# EAGLE design fie (EAGLE 6.6.0)
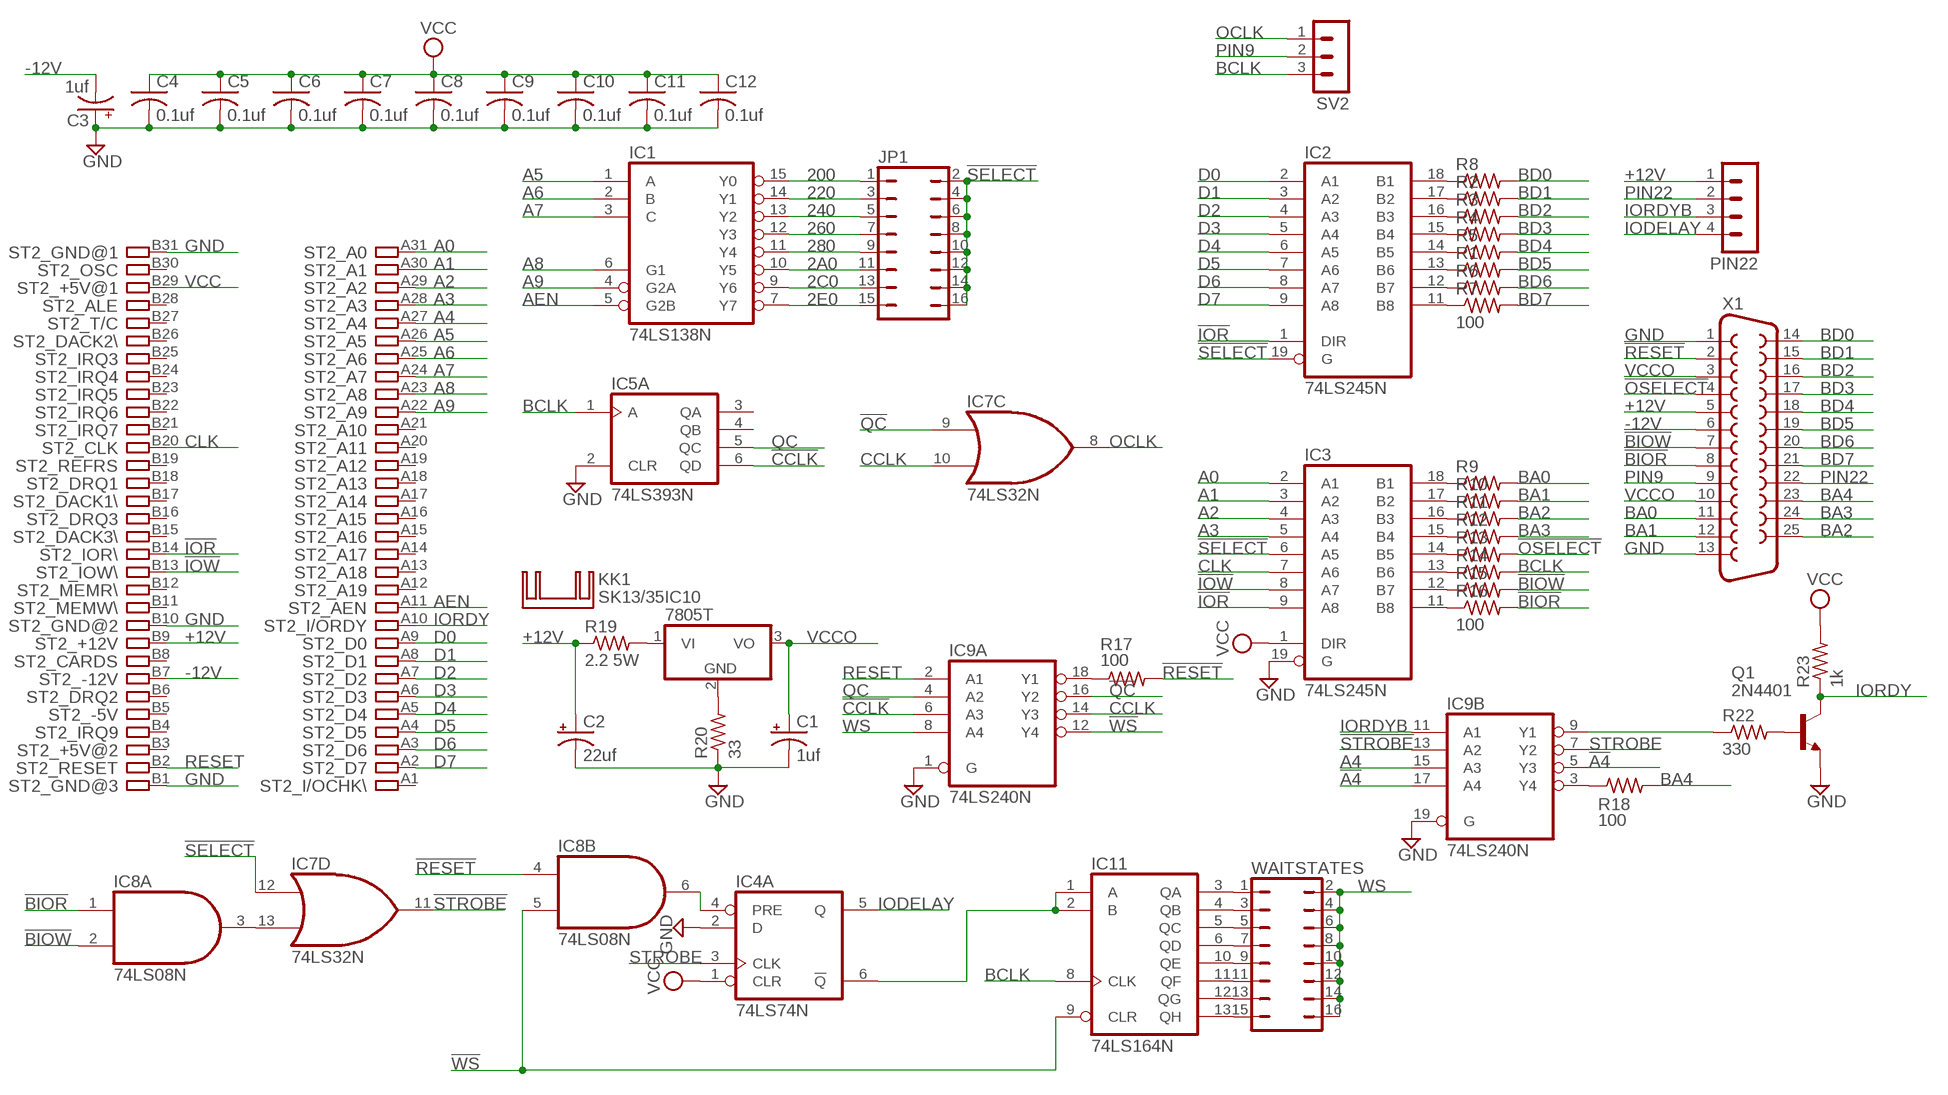
[diagram p0: schematic, sheet 1]

## Parts
C1  1uf  CPOL-USE5-10.5  [E5-10,5]
C2  22uf  CPOL-USE5-10.5  [E5-10,5]
C3  1uf  CPOL-USE5-10.5  [E5-10,5]
C4  0.1uf  C-US050-025X075  [C050-025X075]
C5  0.1uf  C-US050-025X075  [C050-025X075]
C6  0.1uf  C-US050-025X075  [C050-025X075]
C7  0.1uf  C-US050-025X075  [C050-025X075]
C8  0.1uf  C-US050-025X075  [C050-025X075]
C9  0.1uf  C-US050-025X075  [C050-025X075]
C10  0.1uf  C-US050-025X075  [C050-025X075]
C11  0.1uf  C-US050-025X075  [C050-025X075]
C12  0.1uf  C-US050-025X075  [C050-025X075]
IC1  74LS138N  [DIL16]
IC2  74LS245N  [DIL20]
IC3  74LS245N  [DIL20]
IC4  74LS74N  [DIL14]
IC5  74LS393N  [DIL14]
IC7  74LS32N  [DIL14]
IC8  74LS08N  [DIL14]
IC9  74LS240N  [DIL20]
IC10  7805T  [TO220H]
IC11  74LS164N  [DIL14]
JP1  JP8Q  [JP8Q]
KK1  SK13/35  [SK13/35]
PIN22  MA04-1  [MA04-1]
Q1  2N4401  2N4416  [TO92]
R1  R-US_0207/10  [0207/10]
R2  R-US_0207/10  [0207/10]
R3  R-US_0207/10  [0207/10]
R4  R-US_0207/10  [0207/10]
R5  R-US_0207/10  [0207/10]
R6  R-US_0207/10  [0207/10]
R7  100  R-US_0207/10  [0207/10]
R8  R-US_0207/10  [0207/10]
R9  R-US_0207/10  [0207/10]
R10  R-US_0207/10  [0207/10]
R11  R-US_0207/10  [0207/10]
R12  R-US_0207/10  [0207/10]
R13  R-US_0207/10  [0207/10]
R14  R-US_0207/10  [0207/10]
R15  R-US_0207/10  [0207/10]
R16  100  R-US_0207/10  [0207/10]
R17  100  R-US_0207/10  [0207/10]
R18  100  R-US_0207/10  [0207/10]
R19  2.2 5W  R-US_0922/22  [0922/22]
R20  33  R-US_0207/10  [0207/10]
R22  330  R-US_0207/10  [0207/10]
R23  1k  R-US_0207/10  [0207/10]
ST2  IBM8BIT  [IBM8BIT]
SV2  MA03-1  [MA03-1]
WAITSTATES  JP8Q  [JP8Q]
X1  F25H  [F25H]

## Nets
2A0: IC1.10(Y5) JP1.11
2C0: IC1.9(Y6) JP1.13
2E0: IC1.7(Y7) JP1.15
200: IC1.15(Y0) JP1.1
220: IC1.14(Y1) JP1.3
240: IC1.13(Y2) JP1.5
260: IC1.12(Y3) JP1.7
280: IC1.11(Y4) JP1.9
!A4: IC9.5(B:Y3) IC9.17(B:A4)
!BIOR: IC8.1(A:I0) R16.2 X1.8
!BIOW: IC8.2(A:I1) R15.2 X1.7
!CCLK: IC5.6(A:QD) IC9.6(A:A3)
!IOR: IC2.1(DIR) IC3.9(A8) ST2.B14
!IOW: IC3.8(A7) ST2.B13
!OSELECT: R13.2 X1.4
!QC: IC7.9(C:I0) IC9.16(A:Y2)
!RESET: IC8.4(B:I0) R17.2 X1.2
!SELECT: IC2.19(G) IC3.6(A5) IC7.12(D:I0) JP1.2 JP1.4 JP1.6 JP1.8 JP1.10 JP1.12 JP1.14 JP1.16
!STROBE: IC7.11(D:O) IC9.13(B:A2)
!WS: IC8.5(B:I1) IC9.12(A:Y4) IC11.9(CLR)
+12V [Power]: C2.+ PIN22.1 R19.1 ST2.B9 X1.5
-12V [Power]: C3.- ST2.B7 X1.6
A0: IC3.2(A1) ST2.A31
A1: IC3.3(A2) ST2.A30
A2: IC3.4(A3) ST2.A29
A3: IC3.5(A4) ST2.A28
A4: IC9.15(B:A3) ST2.A27
A5: IC1.1(A) ST2.A26
A6: IC1.2(B) ST2.A25
A7: IC1.3(C) ST2.A24
A8: IC1.6(G1) ST2.A23
A9: IC1.4(G2A) ST2.A22
AEN: IC1.5(G2B) ST2.A11
BA0: R9.2 X1.11
BA1: R10.2 X1.12
BA2: R11.2 X1.25
BA3: R12.2 X1.24
BA4: R18.2 X1.23
BCLK: IC5.1(A:A) IC11.8(CLK) R14.2 SV2.3
BD0: R8.2 X1.14
BD1: R2.2 X1.15
BD2: R3.2 X1.16
BD3: R4.2 X1.17
BD4: R5.2 X1.18
BD5: R1.2 X1.19
BD6: R6.2 X1.20
BD7: R7.2 X1.21
CCLK: IC7.10(C:I1) IC9.14(A:Y3)
CLK: IC3.7(A6) ST2.B20
D0: IC2.2(A1) ST2.A9
D1: IC2.3(A2) ST2.A8
D2: IC2.4(A3) ST2.A7
D3: IC2.5(A4) ST2.A6
D4: IC2.6(A5) ST2.A5
D5: IC2.7(A6) ST2.A4
D6: IC2.8(A7) ST2.A3
D7: IC2.9(A8) ST2.A2
GND [Power]: C1.- C2.- C3.+ C4.2 C5.2 C6.2 C7.2 C8.2 C9.2 C10.2 C11.2 C12.2 IC3.19(G) IC4.2(A:D) IC5.2(A:CLR) IC9.1(A:G) IC9.19(B:G) Q1.3(E) R20.1 ST2.B1 ST2.B10 ST2.B31 X1.1 X1.13
IODELAY: IC4.5(A:Q) PIN22.4
IORDY: Q1.1(C) R23.1 ST2.A10
IORDYB: IC9.11(B:A1) PIN22.3
N$2 [Power]: IC10.2(GND) R20.2
N$3: IC2.13(B6) R1.1
N$4: IC2.17(B2) R2.1
N$5: IC2.16(B3) R3.1
N$6: IC2.15(B4) R4.1
N$7: IC2.14(B5) R5.1
N$8: IC2.12(B7) R6.1
N$9: IC2.11(B8) R7.1
N$10: IC2.18(B1) R8.1
N$11: IC3.18(B1) R9.1
N$12: IC3.17(B2) R10.1
N$13: IC3.16(B3) R11.1
N$14: IC3.15(B4) R12.1
N$15: IC3.14(B5) R13.1
N$16: IC3.13(B6) R14.1
N$17: IC3.12(B7) R15.1
N$18: IC3.11(B8) R16.1
N$19: IC9.18(A:Y1) R17.1
N$20: IC11.3(QA) WAITSTATES.1
N$21: IC11.4(QB) WAITSTATES.3
N$23: IC9.3(B:Y4) R18.1
N$25 [Power]: IC10.1(VI) R19.2
N$27: IC11.5(QC) WAITSTATES.5
N$28: IC11.6(QD) WAITSTATES.7
N$29: IC7.13(D:I1) IC8.3(A:O)
N$30: IC4.4(A:PRE) IC8.6(B:O)
N$31: IC11.10(QE) WAITSTATES.9
N$32: IC9.9(B:Y1) R22.1
N$34: IC11.11(QF) WAITSTATES.11
N$35: IC11.12(QG) WAITSTATES.13
N$36: IC11.13(QH) WAITSTATES.15
N$37: Q1.2(B) R22.2
N$39: IC4.6(A:!Q) IC11.1(A) IC11.2(B)
OCLK: IC7.8(C:O) SV2.1
PIN9: SV2.2 X1.9
PIN22 [Power]: PIN22.2 X1.22
QC: IC5.5(A:QC) IC9.4(A:A2)
RESET: IC9.2(A:A1) ST2.B2
STROBE: IC4.3(A:CLK) IC9.7(B:Y2)
VCC [Power]: C4.1 C5.1 C6.1 C7.1 C8.1 C9.1 C10.1 C11.1 C12.1 IC3.1(DIR) IC4.1(A:CLR) R23.2 ST2.B29
VCCO [Power]: C1.+ IC10.3(VO) X1.3 X1.10
WS: IC9.8(A:A4) WAITSTATES.2 WAITSTATES.4 WAITSTATES.6 WAITSTATES.8 WAITSTATES.10 WAITSTATES.12 WAITSTATES.14 WAITSTATES.16
Unconnected: IC4.8(B:!Q) IC4.9(B:Q) IC4.10(B:PRE) IC4.11(B:CLK) IC4.12(B:D) IC4.13(B:CLR) IC5.3(A:QA) IC5.4(A:QB) IC5.8(B:QD) IC5.9(B:QC) IC5.10(B:QB) IC5.11(B:QA) IC5.12(B:CLR) IC5.13(B:A) IC7.1(A:I0) IC7.2(A:I1) IC7.3(A:O) IC7.4(B:I0) IC7.5(B:I1) IC7.6(B:O) IC8.8(C:O) IC8.9(C:I0) IC8.10(C:I1) IC8.11(D:O) IC8.12(D:I0) IC8.13(D:I1) ST2.A1 ST2.A12 ST2.A13 ST2.A14 ST2.A15 ST2.A16 ST2.A17 ST2.A18 ST2.A19 ST2.A20 ST2.A21 ST2.B3 ST2.B4 ST2.B5 ST2.B6 ST2.B8 ST2.B11 ST2.B12 ST2.B15 ST2.B16 ST2.B17 ST2.B18 ST2.B19 ST2.B21 ST2.B22 ST2.B23 ST2.B24 ST2.B25 ST2.B26 ST2.B27 ST2.B28 ST2.B30

## Power pins joined to a net without a drawn wire
GND: IC1.8(GND) IC2.10(GND) IC3.10(GND) IC4.7(P:GND) IC5.7(P:GND) IC7.7(P:GND) IC8.7(P:GND) IC9.10(P:GND) IC11.7(GND)
VCC: IC1.16(VCC) IC2.20(VCC) IC3.20(VCC) IC4.14(P:VCC) IC5.14(P:VCC) IC7.14(P:VCC) IC8.14(P:VCC) IC9.20(P:VCC) IC11.14(VCC)

## Library data of the parts
C1-C3 = rcl:CPOL-US: POLARIZED CAPACITOR, American symbol
C4-C12 = rcl:C-US: CAPACITOR, American symbol
IC1 = 74xx-us:74*138: 3-line to 8-line DECODER/DEMULTIPLEXER
IC2 IC3 = 74xx-us:74*245: Octal BUS TRANSCEIVER, 3-state
IC4 = 74xx-us:74*74: Dual D type positive edge triggered FLIP FLOP, preset and clear
IC5 = 74xx-us:74*393: Dual 4-bit decade and binary COUNTER
IC7 = 74xx-us:74*32: Quad 2-input OR gate
IC8 = 74xx-us:74*08: Quad 2-input AND gate
IC9 = 74xx-us:74*240: Octal BUFFER and LINE DRIVER, 3-state
IC10 = linear:78*: Positive VOLTAGE REGULATOR Source: http://cache.national.com/ds/LM/LM78L05.pdf http://www.fairchildsemi.com/ds/LM/LM7805.pdf
IC11 = 74xx-us:74*164: 8-bit parallel out SHIFT REGISTER
JP1 WAITSTATES = jumper:JP8Q: JUMPER
KK1 = heatsink:SK13/35: HEATSINK manufacturer Fischer/distributor Buerklin
PIN22 = con-lstb:MA04-1: PIN HEADER; OC_FARNELL: unknown; OC_NEWARK: unknown
Q1 = transistor-npn:2N4416: NPN Transistor
R1-R20 R22 R23 = rcl:R-US_: RESISTOR, American symbol
ST2 = con-pc:IBM8BIT: 8-bit CARD IBM/PC-AT
SV2 = con-lstb:MA03-1: PIN HEADER; OC_FARNELL: unknown; OC_NEWARK: unknown
X1 = con-subd:F25: SUB-D; OC_FARNELL: unknown; OC_NEWARK: unknown

## Net classes
1 Power: width 0.762 mm, clearance 0.254 mm

## Board
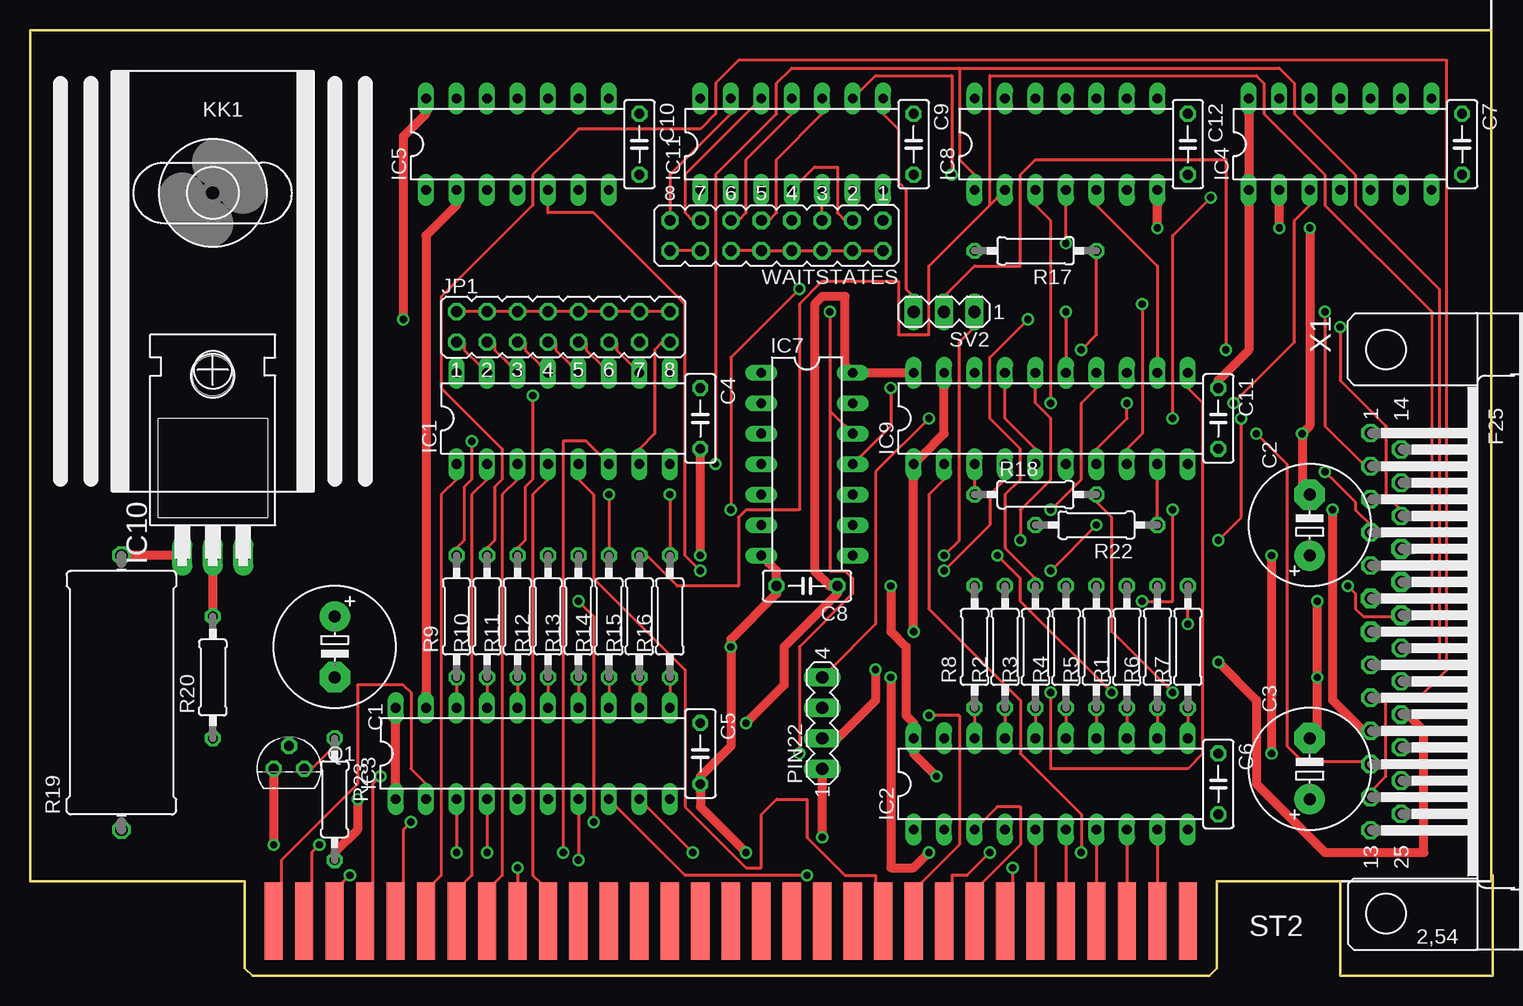
[diagram p1: board, top side]
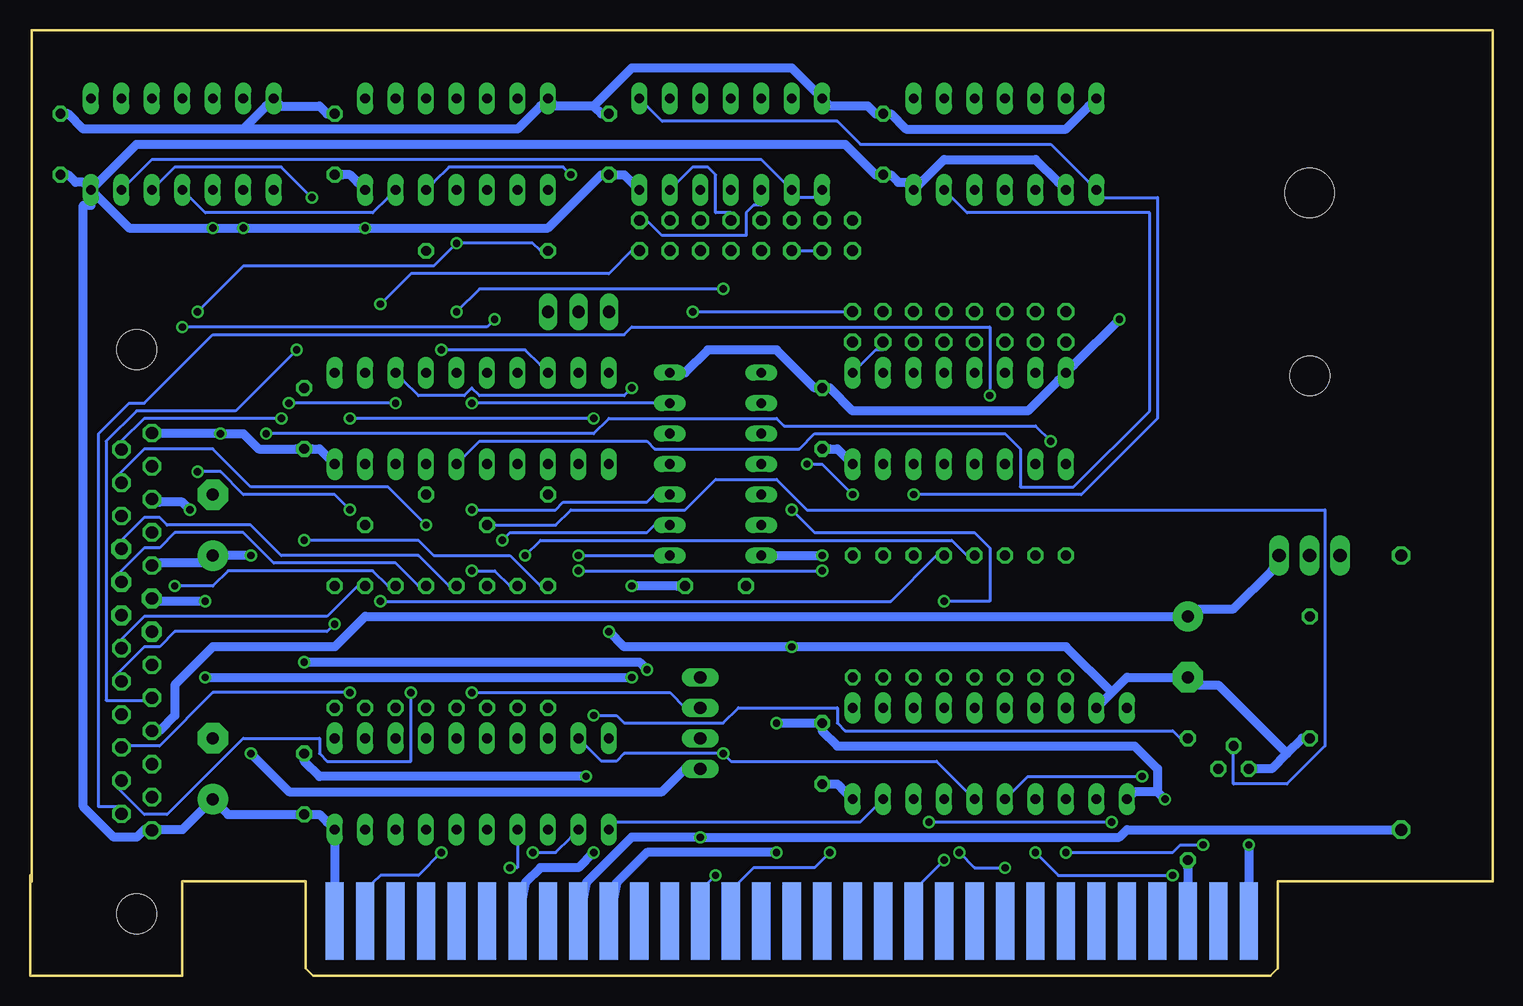
[diagram p2: board, bottom side, seen from below]

Size 121.92 x 78.87 mm. Coordinates in mm from the lower left corner, seen from the top.
Outline: 121.79,7.87 121.79,78.87 0,78.87 0,7.87 17.91,7.87 17.91,0.64 18.54,0 97.79,0 98.3,0 98.93,0.64 98.93,7.87 109.22,7.87 109.22,0 121.92,0 121.92,8.38
Copper layers (1*16): Top 0.035mm / dielectric 1.5mm / Bottom 0.035mm
Design rules "olimex10mil": minimum track width 10mil, minimum drill 24mil, track to track 10mil, track to pad 10mil, pad to pad 10mil, via to via 10mil, smd to smd 10mil, copper to edge 40mil, drill to drill 10mil, minimum pad ring 10mil, minimum via ring 8mil, stop-mask expansion 0mil, vias tented up to drill 0mil, thermal gap 10mil

### Footprints (pad centres in the part's own frame; a part is rotated, then mirrored left to right if it is on the bottom)
E5-10,5 = drill 1.016 pad 2.54: + -2.54,0 | drill 1.016 pad 2.54 octagon: - 2.54,0
C050-025X075 = drill 0.813 octagon: 1 -2.54,0; 2 2.54,0
DIL16 = drill 0.813 long: 1 -8.89,-3.81; 2 -6.35,-3.81; 3 -3.81,-3.81; 4 -1.27,-3.81; 5 1.27,-3.81; 6 3.81,-3.81; 7 6.35,-3.81; 8 8.89,-3.81; 9 8.89,3.81; 10 6.35,3.81; 11 3.81,3.81; 12 1.27,3.81; 13 -1.27,3.81; 14 -3.81,3.81; 15 -6.35,3.81; 16 -8.89,3.81
DIL20 = drill 0.813 long: 1 -11.43,-3.81; 2 -8.89,-3.81; 3 -6.35,-3.81; 4 -3.81,-3.81; 5 -1.27,-3.81; 6 1.27,-3.81; 7 3.81,-3.81; 8 6.35,-3.81; 9 8.89,-3.81; 10 11.43,-3.81; 11 11.43,3.81; 12 8.89,3.81; 13 6.35,3.81; 14 3.81,3.81; 15 1.27,3.81; 16 -1.27,3.81; 17 -3.81,3.81; 18 -6.35,3.81; 19 -8.89,3.81; 20 -11.43,3.81
DIL14 = drill 0.813 long: 1 -7.62,-3.81; 2 -5.08,-3.81; 3 -2.54,-3.81; 4 0,-3.81; 5 2.54,-3.81; 6 5.08,-3.81; 7 7.62,-3.81; 8 7.62,3.81; 9 5.08,3.81; 10 2.54,3.81; 11 0,3.81; 12 -2.54,3.81; 13 -5.08,3.81; 14 -7.62,3.81
TO220H = drill 1.118 long: 1 -2.54,-10.16; 2 0,-10.16; 3 2.54,-10.16 | hole 3.302: 0,4.826
JP8Q = drill 0.914 octagon: 1 -8.89,-1.27; 2 -8.89,1.27; 3 -6.35,-1.27; 4 -6.35,1.27; 5 -3.81,-1.27; 6 -3.81,1.27; 7 -1.27,-1.27; 8 -1.27,1.27; 9 1.27,-1.27; 10 1.27,1.27; 11 3.81,-1.27; 12 3.81,1.27; 13 6.35,-1.27; 14 6.35,1.27; 15 8.89,-1.27; 16 8.89,1.27
MA04-1 = drill 1.016 long: 1 -3.81,0; 2 -1.27,0; 3 1.27,0; 4 3.81,0
TO92 = drill 0.813 octagon: 1 1.27,0; 2 0,1.905; 3 -1.27,0
0207/10 = drill 0.813 octagon: 1 -5.08,0; 2 5.08,0
0922/22 = drill 1.016 octagon: 1 -11.43,0; 2 11.43,0
IBM8BIT = smd 1.524 x 6.477: A1 -25.4,5.08; A2 -27.94,5.08; A3 -30.48,5.08; A4 -33.02,5.08; A5 -35.56,5.08; A6 -38.1,5.08; A7 -40.64,5.08; A8 -43.18,5.08; A9 -45.72,5.08; A10 -48.26,5.08; A11 -50.8,5.08; A12 -53.34,5.08; A13 -55.88,5.08; A14 -58.42,5.08; A15 -60.96,5.08; A16 -63.5,5.08; A17 -66.04,5.08; A18 -68.58,5.08; A19 -71.12,5.08; A20 -73.66,5.08; A21 -76.2,5.08; A22 -78.74,5.08; A23 -81.28,5.08; A24 -83.82,5.08; A25 -86.36,5.08; A26 -88.9,5.08; A27 -91.44,5.08; A28 -93.98,5.08; A29 -96.52,5.08; A30 -99.06,5.08; A31 -101.6,5.08 | smd 1.524 x 6.477 bottom: B1 -25.4,5.08; B2 -27.94,5.08; B3 -30.48,5.08; B4 -33.02,5.08; B5 -35.56,5.08; B6 -38.1,5.08; B7 -40.64,5.08; B8 -43.18,5.08; B9 -45.72,5.08; B10 -48.26,5.08; B11 -50.8,5.08; B12 -53.34,5.08; B13 -55.88,5.08; B14 -58.42,5.08; B15 -60.96,5.08; B16 -63.5,5.08; B17 -66.04,5.08; B18 -68.58,5.08; B19 -71.12,5.08; B20 -73.66,5.08; B21 -76.2,5.08; B22 -78.74,5.08; B23 -81.28,5.08; B24 -83.82,5.08; B25 -86.36,5.08; B26 -88.9,5.08; B27 -91.44,5.08; B28 -93.98,5.08; B29 -96.52,5.08; B30 -99.06,5.08; B31 -101.6,5.08
MA03-1 = drill 1.016 long: 1 -2.54,0; 2 0,0; 3 2.54,0
4,1 = hole 4.1: 0,0
F25H = drill 1.016 octagon: 1 -16.561,-1.27; 2 -13.792,-1.27; 3 -11.049,-1.27; 4 -8.28,-1.27; 5 -5.512,-1.27; 8 2.769,-1.27; 9 5.512,-1.27; 10 8.28,-1.27; 11 11.049,-1.27; 12 13.792,-1.27; 13 16.561,-1.27; 14 -15.189,1.27; 15 -12.421,1.27; 16 -9.652,1.27; 20 1.372,1.27; 21 4.14,1.27; 22 6.909,1.27; 23 9.652,1.27; 24 12.421,1.27; 25 15.189,1.27 | drill 1.016 pad 1.67 octagon: 6 -2.769,-1.27; 7 0,-1.27; 17 -6.909,1.27; 18 -4.14,1.27; 19 -1.372,1.27 | hole 3.302: -23.52,0; 23.52,0

### Placement (x,y rotation side)
C1  25.4,27.43 270 top
C2  106.68,37.59 90 top
C3  106.68,17.27 90 top
C4  55.88,46.48 270 top
C5  55.88,18.54 270 top
C6  99.06,16 270 top
C7  119.38,69.34 270 top
C8  64.77,32.51 180 top
C9  73.66,69.34 270 top
C10  50.8,69.34 270 top
C11  99.06,46.48 270 top
C12  96.52,69.34 270 top
IC1  44.45,46.48 0 top
IC2  85.09,16 0 top
IC3  41.91,18.54 0 top
IC4  109.22,69.34 0 top
IC5  40.64,69.34 0 top
IC7  64.77,42.67 270 top
IC8  86.36,69.34 0 top
IC9  85.09,46.48 0 top
IC10  15.24,45.21 0 top
IC11  63.5,69.34 0 top
JP1  44.45,54.1 0 top
KK1  15.24,61.72 90 top
PIN22  66.04,21.08 90 top
Q1  21.59,17.27 0 top
R1  91.44,27.43 90 top
R2  81.28,27.43 90 top
R3  83.82,27.43 90 top
R4  86.36,27.43 90 top
R5  88.9,27.43 90 top
R6  93.98,27.43 90 top
R7  96.52,27.43 90 top
R8  78.74,27.43 90 top
R9  35.56,29.97 90 top
R10  38.1,29.97 90 top
R11  40.64,29.97 90 top
R12  43.18,29.97 90 top
R13  45.72,29.97 90 top
R14  48.26,29.97 90 top
R15  50.8,29.97 90 top
R16  53.34,29.97 90 top
R17  83.82,60.45 180 top
R18  83.82,40.13 0 top
R19  7.62,23.62 90 top
R20  15.24,24.89 90 top
R22  88.9,37.59 180 top
R23  25.4,14.73 270 top
ST2  121.92,-0.51 0 top
SV2  76.2,55.37 180 top
U$1  [4,1]  15.24,65.28 0 top
WAITSTATES  62.23,61.72 180 top
X1  113.03,28.7 270 top

### Tracks (layer width: path | path; a pad name or v marks a point on that pad's centre or on a via)
2A0
  Top 0.254: IC1.10 50.17,50.93 48.89,52.2 48.89,52.83 JP1.11
2C0
  Bottom 0.254: IC1.9 52.7,50.93 51.44,52.2 50.8,52.2 JP1.13
2E0
  Top 0.254: IC1.7 50.8,43.94 52.07,45.21 52.07,52.2 52.7,52.83 JP1.15
200
  Top 0.254: IC1.15 37.47,50.93 36.2,52.2 36.2,52.83 JP1.1
220
  Top 0.254: IC1.14 40,50.93 38.73,52.2 38.73,52.83 JP1.3
240
  Top 0.254: IC1.13 42.55,50.93 41.28,52.2 41.28,52.83 JP1.5
260
  Top 0.254: IC1.12 45.09,50.93 43.81,52.2 43.81,52.83 JP1.7
280
  Top 0.254: IC1.11 47.62,50.93 46.36,52.2 46.36,52.83 JP1.9
!A4
  Top 0.254: IC9.5 83.82,43.94 81.28,46.48 81.28,49.02 IC9.17
!BIOR  (via drill 0.61)
  Top 0.254: v53.34,40.13 53.34,35.69 R16.2 | v57.15,42.67 57.15,66.8 62.23,71.88 62.23,74.42 63.5,75.69 77.47,75.69 | 77.47,75.69 77.47,68.07 78.74,66.8 IC8.1 | 77.47,75.69 104.14,75.69 105.41,74.42 105.41,71.88 110.49,66.8 110.49,64.26 117.47,57.28 117.47,26.16 112.39,26.16 X1.8
  Bottom 0.254: v53.34,40.13 55.88,42.67 v57.15,42.67
!BIOW
  Top 0.254: 80.01,64.26 80.65,64.9 IC8.2 | 80.01,64.26 74.93,59.18 74.93,53.47 72.39,53.47 72.39,57.91 66.04,57.91 64.14,56.01 64.14,38.86 59.69,38.86 59.05,38.23 59.05,32.51 53.98,32.51 51.44,35.05 R15.2 | 80.01,64.26 80.01,75.06 102.23,75.06 102.87,74.42 102.87,71.88 107.95,66.8 107.95,64.26 116.84,55.37 116.84,28.7 112.39,28.7 X1.7
!CCLK
  Bottom 0.254: IC9.6 85.72,43.31 84.45,44.58 70.48,44.58 69.85,43.94 57.78,43.94 56.52,45.21 40.64,45.21 39.37,43.94 39.37,40.77 34.92,40.77 28.58,47.12 28.58,63.63 43.81,63.63 45.09,64.9 IC5.6
!IOR  (via drill 0.61)
  Top 0.254: v55.25,10.29 51.44,14.1 IC3.9
  Bottom 0.254: IC2.1 73.03,12.83 52.7,12.83 51.44,14.1 IC3.9 | v55.25,10.29 56.52,9.02 61.59,9.02 62.87,7.75 ST2.B14
!IOW  (via drill 0.61)
  Top 0.254: v64.77,8.38 54.61,8.38 48.89,14.1 IC3.8
  Bottom 0.254: v64.77,8.38 65.41,7.75 ST2.B13
!OSELECT  (via drill 0.61)
  Top 0.254: v92.71,31.24 95.25,31.24 v95.25,38.86 | v107.95,42.04 110.49,39.5 110.49,38.86 111.76,37.59 X1.4
  Bottom 0.254: v92.71,31.24 50.17,31.24 46.36,35.05 R13.2 | v95.25,38.86 96.52,40.13 104.14,40.13 106.05,42.04 v107.95,42.04
!QC  (via drill 0.61)
  Top 0.254: v82.55,36.32 82.55,38.86 85.09,41.4 85.09,46.48 83.82,47.75 83.82,49.02 IC9.16
  Bottom 0.254: v82.55,36.32 81.91,36.96 70.48,36.96 69.85,37.59 IC7.9
!RESET  (via drill 0.61)
  Top 0.254: v86.36,61.09 86.36,64.26 IC8.4 | v107.95,55.37 107.95,45.85 111.12,42.67 X1.2
  Bottom 0.254: R17.2 79.38,60.45 80.01,61.09 v86.36,61.09 88.27,59.18 104.14,59.18 v107.95,55.37
!SELECT  (via drill 0.61)
  Top 0.254: JP1.2 36.2,55.37 37.47,55.37 JP1.4 38.73,55.37 40,55.37 JP1.6 41.28,55.37 42.55,55.37 JP1.8 43.81,55.37 45.09,55.37 JP1.10 46.36,55.37 47.62,55.37 JP1.12 48.89,55.37 50.17,55.37 JP1.14 51.44,55.37 52.7,55.37 JP1.16 | 66.68,47.12 67.94,45.85 IC7.12 | v66.68,55.37 66.68,47.12 | v64.14,18.54 64.14,27.43 68.58,31.88 68.58,33.15 67.94,33.78 66.68,33.78 66.68,47.12
  Bottom 0.254: IC3.6 43.81,15.37 46.36,17.91 63.5,17.91 v64.14,18.54 72.39,18.54 73.03,17.91 74.3,17.91 75.56,19.18 IC2.19 | v66.68,55.37 53.98,55.37 JP1.16
!STROBE  (via drill 0.61)
  Top 0.254: v71.75,49.02 71.75,45.85 69.22,43.31 IC7.11
  Bottom 0.254: v71.75,49.02 72.39,48.39 84.45,48.39 85.09,49.02 85.72,48.39 89.53,48.39 90.81,49.66 IC9.13
!WS  (via drill 0.61)
  Top 0.254: v76.84,66.8 76.84,75.06 70.48,75.06 69.22,73.79 IC11.9 | IC9.12 93.98,51.56 93.98,59.18 88.9,64.26 IC8.5
  Bottom 0.254: v76.84,66.8 77.47,67.44 87,67.44 88.27,66.17 IC8.5
+12V  (via drill 0.61)
  Top 0.762: v66.04,11.56 66.04,16.64 PIN22.1 | v103.5,18.54 v103.5,35.05
  Bottom 0.762: X1.5 111.12,34.42 107.31,34.42 C2.+ 106.05,35.05 v103.5,35.05 | R19.1 8.25,12.19 30.48,12.19 31.11,11.56 v66.04,11.56 71.75,11.56 75.56,7.75 ST2.B9 | v103.5,18.54 100.33,15.37 69.22,15.37 67.31,17.27 PIN22.1
-12V  (via drill 0.61)
  Top 0.762: v107.31,31.24 v107.31,24.89 107.31,20.45 C3.- | v74.93,10.29 73.66,9.02 71.75,9.02 v71.75,24.89
  Bottom 0.762: v107.31,31.24 111.12,31.24 X1.6 | v74.93,10.29 76.2,9.02 79.38,9.02 80.65,7.75 ST2.B7 | v107.31,24.89 v71.75,24.89
A0
  Top 0.254: IC3.2 33.02,16 31.75,17.27 31.75,23.62 31.11,24.26 27.31,24.26 27.31,16 20.95,9.65 20.95,7.75 ST2.A31
A1  (via drill 0.61)
  Top 0.254: v35.56,10.29 35.56,13.46 IC3.3 | v24.13,10.92 23.5,10.29 23.5,7.75 ST2.A30
  Bottom 0.254: v35.56,10.29 26.67,10.29 26.03,10.92 v24.13,10.92
A2  (via drill 0.61)
  Top 0.254: v38.1,10.29 38.1,13.46 IC3.4 | v26.67,8.38 26.03,7.75 ST2.A29
  Bottom 0.254: v38.1,10.29 36.2,8.38 v26.67,8.38
A3  (via drill 0.61)
  Top 0.254: v29.21,16.64 28.58,16 28.58,7.75 ST2.A28
  Bottom 0.254: v29.21,16.64 38.73,16.64 40,15.37 IC3.5
A4  (via drill 0.61)
  Top 0.254: v86.36,55.37 86.36,51.56 IC9.15 | v64.14,57.28 58.42,51.56 v58.42,38.86 | v45.72,31.24 46.99,29.97 v46.99,12.83 | v31.75,12.83 31.11,12.19 31.11,7.75 ST2.A27
  Bottom 0.254: v86.36,55.37 84.45,57.28 v64.14,57.28 | v58.42,38.86 56.52,36.96 43.18,36.96 41.91,35.69 41.91,31.24 v45.72,31.24 | v46.99,12.83 v31.75,12.83
A5
  Top 0.254: IC1.1 35.56,41.4 34.29,40.13 34.29,8.38 33.66,7.75 ST2.A26
A6
  Top 0.254: IC1.2 38.1,41.4 36.83,40.13 36.83,8.38 36.2,7.75 ST2.A25
A7
  Top 0.254: IC1.3 40.64,41.4 39.37,40.13 39.37,8.38 38.73,7.75 ST2.A24
A8  (via drill 0.61)
  Top 0.254: v44.45,10.29 44.45,44.58 46.36,44.58 47.62,43.31 IC1.6 | v40.64,9.02 40.64,7.75 ST2.A23
  Bottom 0.254: v44.45,10.29 43.18,9.02 v40.64,9.02
A9
  Top 0.254: IC1.4 43.18,41.4 41.91,40.13 41.91,8.38 42.55,7.75 ST2.A22
AEN
  Top 0.254: IC1.5 45.72,41.4 46.99,40.13 46.99,33.15 54.61,25.53 54.61,14.1 59.69,9.02 60.96,9.02 60.96,13.46 62.23,14.73 64.77,14.73 64.77,11.56 67.94,8.38 70.48,8.38 70.48,7.75 ST2.A11
BA0  (via drill 0.61)
  Top 0.254: v36.83,44.58 36.83,41.4 36.2,40.77 36.2,36.32 35.56,35.69 R9.2 | v102.23,45.21 104.78,42.67 104.78,19.18 106.05,17.91 111.12,17.91 X1.11
  Bottom 0.254: v36.83,44.58 38.1,45.85 59.05,45.85 59.69,46.48 73.66,46.48 74.93,45.21 v102.23,45.21
BA1
  Top 0.254: R10.2 38.1,35.69 38.73,36.32 38.73,40.77 39.37,41.4 39.37,43.94 34.29,49.02 34.29,56.64 41.91,64.26 41.91,66.8 45.72,70.61 55.88,70.61 57.15,71.88 57.15,74.42 59.05,76.33 118.11,76.33 118.11,25.53 115.57,22.99 113.03,22.99 113.03,16.64 111.76,15.37 X1.12
BA2  (via drill 0.61)
  Top 0.254: v41.91,48.39 41.91,41.4 41.28,40.77 41.28,36.32 40.64,35.69 R11.2
  Bottom 0.254: v41.91,48.39 41.91,54.1 71.75,54.1 72.39,53.47 106.68,53.47 112.39,47.75 113.67,47.75 116.2,45.21 116.2,14.1 114.3,14.1 X1.25
BA3  (via drill 0.61)
  Top 0.254: v80.65,35.05 82.55,33.15 82.55,31.24 v90.17,23.62
  Bottom 0.254: v80.65,35.05 79.38,36.32 45.09,36.32 43.81,35.05 R12.2 | v90.17,23.62 90.17,17.91 97.16,17.91 97.79,18.54 97.79,19.81 104.14,19.81 110.49,13.46 112.39,13.46 114.94,16 X1.24
BA4  (via drill 0.61)
  Top 0.254: v95.25,23.62 90.17,28.7 90.17,38.23 88.9,39.5 R18.2
  Bottom 0.254: v95.25,23.62 106.68,23.62 111.12,19.18 113.67,19.18 X1.23
BCLK  (via drill 0.61)
  Top 0.254: v48.26,40.13 48.26,35.69 R14.2 | SV2.3 73.66,56.64 73.03,57.28 73.03,65.53 72.39,66.17 72.39,70.61 71.12,71.88 IC11.8
  Bottom 0.254: IC11.8 70.48,72.52 69.22,71.25 54.61,71.25 52.7,69.34 36.83,69.34 33.66,66.17 IC5.1 32.39,64.9 27.94,64.9 27.94,46.48 34.29,40.13 v48.26,40.13
BD0  (via drill 0.61)
  Top 0.254: v99.06,36.32 100.97,38.23 v100.97,46.48
  Bottom 0.254: v99.06,36.32 89.53,36.32 88.27,35.05 81.91,35.05 79.38,32.51 R8.2 | v100.97,46.48 112.39,46.48 114.3,44.58 X1.14
BD1  (via drill 0.61)
  Top 0.254: v85.09,33.78 v88.9,37.59
  Bottom 0.254: v85.09,33.78 83.19,33.78 81.91,32.51 R2.2 | v88.9,37.59 92.08,40.77 103.5,40.77 106.68,43.94 112.39,43.94 114.94,41.4 X1.15
BD2  (via drill 0.61)
  Top 0.254: v83.19,54.74 80.01,51.56 80.01,46.48 82.55,43.94 82.55,41.4 81.28,40.13 81.28,35.69 83.82,33.15 R3.2 | v109.22,54.1 109.22,49.66 113.03,45.85 113.03,40.13 114.3,38.86 X1.16
  Bottom 0.254: v83.19,54.74 83.82,54.1 v109.22,54.1
BD3
  Bottom 0.254: R4.2 87,32.51 89.53,35.05 100.97,35.05 103.5,37.59 110.49,37.59 111.12,38.23 112.39,38.23 114.3,36.32 X1.17
BD4
  Bottom 0.254: R5.2 89.53,32.51 91.44,34.42 101.6,34.42 104.14,36.96 109.86,36.96 111.12,35.69 112.39,35.69 114.94,33.15 X1.18
BD5  (via drill 0.61)
  Top 0.254: v109.86,32.51 110.49,31.88 110.49,30.61 111.12,29.97 113.67,29.97 X1.19
  Bottom 0.254: v109.86,32.51 106.68,32.51 105.41,33.78 93.34,33.78 92.08,32.51 R1.2
BD6
  Bottom 0.254: R6.2 94.62,32.51 97.16,29.97 112.39,29.97 114.3,28.07 X1.20
BD7  (via drill 0.61)
  Top 0.254: v96.52,29.34 96.52,31.88 R7.2
  Bottom 0.254: v96.52,29.34 97.16,28.7 109.86,28.7 111.12,27.43 112.39,27.43 114.94,24.89 X1.21
CCLK  (via drill 0.61)
  Top 0.254: v85.09,38.86 87.63,41.4 87.63,47.75 88.9,49.02 IC9.14
  Bottom 0.254: v85.09,38.86 78.11,38.86 77.47,39.5 70.48,39.5 69.85,40.13 IC7.10
CLK  (via drill 0.61)
  Top 0.254: v45.72,9.65 45.72,13.46 IC3.7
  Bottom 0.254: v45.72,9.65 47.62,7.75 ST2.B20
D0  (via drill 0.61)
  Top 0.254: v80.01,10.29 78.11,8.38 76.84,8.38 76.84,7.75 ST2.A9
  Bottom 0.254: v80.01,10.29 78.11,10.29 76.84,11.56 IC2.2
D1
  Top 0.254: IC2.3 79.38,12.83 80.65,14.1 82.55,14.1 82.55,10.92 79.38,7.75 ST2.A8
D2  (via drill 0.61)
  Top 0.254: v81.91,9.02 81.91,7.75 ST2.A7
  Bottom 0.254: v81.91,9.02 81.28,9.02 81.28,10.92 IC2.4
D3
  Top 0.254: IC2.5 83.82,10.92 83.82,7.75 ST2.A6
D4
  Top 0.254: IC2.6 86.36,10.92 86.36,7.75 ST2.A5
D5
  Top 0.254: IC2.7 88.9,10.92 88.9,7.75 ST2.A4
D6
  Top 0.254: IC2.8 91.44,10.92 91.44,7.75 ST2.A3
D7
  Top 0.254: IC2.9 93.98,10.92 93.98,7.75 ST2.A2
GND  (via drill 0.61)
  Top 0.762: C2.- 106.05,40.77 v106.05,45.21 106.68,45.85 v106.68,62.36 | v104.14,62.36 104.14,64.26 IC4.2 | v93.98,62.36 93.98,64.26 IC8.7 | IC7.7 61.59,34.42 62.23,33.78 62.23,33.15 C8.2 62.23,31.88 58.42,28.07 v58.42,27.43 58.42,19.18 55.88,16.64 C5.2 55.88,15.37 55.88,14.1 v59.69,10.29 | v55.88,35.05 55.88,43.31 C4.2 | IC9.19 76.2,49.02 76.2,45.21 74.3,43.31 IC9.1 73.66,41.4 v73.66,28.7 | v20.32,10.92 20.32,16.64 Q1.3 | IC5.2 35.56,64.26 33.02,61.72 33.02,23.62 IC3.19
  Bottom 0.762: ST2.B1 96.52,7.75 96.52,10.92 IC2.10 97.16,12.83 97.79,13.46 98.42,13.46 C6.2 99.69,13.46 105.41,13.46 106.05,14.1 C3.+ 107.31,14.1 109.22,12.19 111.12,12.19 X1.13 112.39,12.19 113.03,11.56 114.94,11.56 117.47,14.1 117.47,64.26 116.84,64.26 IC4.7 | IC9.10 97.16,43.31 97.79,43.94 98.42,43.94 C11.2 99.69,43.94 102.87,43.94 104.14,45.21 v106.05,45.21 111.12,45.21 X1.1 | IC8.7 94.62,66.17 95.25,66.8 95.89,66.8 C12.2 | IC11.7 71.75,66.17 72.39,66.8 73.03,66.8 C9.2 74.3,66.8 78.74,62.36 v93.98,62.36 v104.14,62.36 v106.68,62.36 113.67,62.36 116.2,64.9 IC4.7 | C7.2 118.75,66.8 118.11,66.17 117.47,66.17 IC4.7 | IC1.8 53.98,43.31 54.61,43.94 55.25,43.94 C4.2 | IC3.10 53.98,15.37 54.61,16 55.25,16 C5.2 | v55.88,35.05 59.69,35.05 IC7.7 | v59.69,10.29 70.48,10.29 73.03,7.75 ST2.B10 | IC5.2 36.2,66.17 38.1,68.07 45.72,68.07 47.62,66.17 IC5.7 48.89,66.17 49.53,66.17 50.17,66.8 C10.2 51.44,66.8 53.98,69.34 113.03,69.34 116.2,66.17 IC4.7 | 17.14,18.54 18.42,17.27 19.69,17.27 Q1.3 | 17.14,18.54 15.88,19.81 R20.1 | 31.75,23.62 30.48,24.89 26.03,24.89 C1.- 24.77,24.26 22.86,24.26 17.14,18.54 | 31.75,23.62 32.39,22.99 IC3.19 | v73.66,28.7 72.39,27.43 v58.42,27.43 35.56,27.43 31.75,23.62 | v20.32,10.92 20.32,7.75 ST2.B31
IODELAY  (via drill 0.61)
  Top 0.254: v98.42,64.9 95.25,61.72 v95.25,46.48 | v74.93,46.48 70.48,42.04 70.48,29.34 66.68,25.53 PIN22.4
  Bottom 0.254: v98.42,64.9 100.97,67.44 109.86,67.44 111.12,66.17 IC4.5 | v74.93,46.48 v95.25,46.48
IORDY  (via drill 0.61)
  Top 0.254: Q1.1 23.5,17.27 25.4,19.18 R23.1 | v74.93,21.72 77.47,21.72 77.47,10.92 74.3,7.75 ST2.A10
  Bottom 0.254: v74.93,21.72 73.03,21.72 72.39,21.08 64.14,21.08 62.87,22.35 54.61,22.35 54.61,21.08 53.98,20.45 26.67,20.45 26.03,19.81 R23.1
IORDYB  (via drill 0.61)
  Top 0.254: v85.09,23.62 85.09,17.27 96.52,17.27 97.79,18.54 97.79,47.75 96.52,49.02 IC9.11
  Bottom 0.254: v85.09,23.62 68.58,23.62 67.31,22.35 PIN22.3
N$2
  Top 0.762: R20.2 15.24,30.61 15.24,33.78 IC10.2
N$3
  Top 0.254: IC2.13 91.44,21.08 91.44,21.72 R1.1
N$4
  Top 0.254: IC2.17 81.28,21.08 81.28,21.72 R2.1
N$5
  Top 0.254: IC2.16 83.82,21.08 83.82,21.72 R3.1
N$6
  Top 0.254: IC2.15 86.36,21.08 86.36,21.72 R4.1
N$7
  Top 0.254: IC2.14 88.9,21.08 88.9,21.72 R5.1
N$8
  Top 0.254: IC2.12 93.98,21.08 93.98,21.72 R6.1
N$9
  Top 0.254: IC2.11 96.52,21.08 96.52,21.72 R7.1
N$10
  Top 0.254: IC2.18 78.74,21.08 78.74,21.72 R8.1
N$11
  Top 0.254: IC3.18 35.56,23.62 35.56,24.26 R9.1
N$12
  Top 0.254: IC3.17 38.1,23.62 38.1,24.26 R10.1
N$13
  Top 0.254: IC3.16 40.64,23.62 40.64,24.26 R11.1
N$14
  Top 0.254: IC3.15 43.18,23.62 43.18,24.26 R12.1
N$15
  Top 0.254: IC3.14 45.72,23.62 45.72,24.26 R13.1
N$16
  Top 0.254: IC3.13 48.26,23.62 48.26,24.26 R14.1
N$17
  Top 0.254: IC3.12 50.8,23.62 50.8,24.26 R15.1
N$18
  Top 0.254: IC3.11 53.34,23.62 53.34,24.26 R16.1
N$19  (via drill 0.61)
  Top 0.254: v87.63,52.2 88.9,53.47 88.9,59.82 R17.1
  Bottom 0.254: v87.63,52.2 80.65,52.2 79.38,50.93 IC9.18
N$20
  Bottom 0.254: IC11.3 60.96,64.26 61.59,64.26 62.23,63.63 62.23,61.72 69.22,61.72 70.48,62.99 WAITSTATES.1
N$21
  Top 0.254: IC11.4 64.14,66.17 65.41,67.44 67.31,67.44 67.31,63.63 67.94,62.99 WAITSTATES.3
N$23
  Top 0.254: R18.1 78.74,40.77 78.74,41.4 IC9.3
N$25
  Top 0.762: R19.2 8.25,35.05 12.06,35.05 IC10.1
N$27
  Top 0.254: IC11.5 66.04,64.26 66.04,63.63 WAITSTATES.5
N$28
  Bottom 0.254: IC11.6 67.94,66.17 66.68,67.44 65.41,67.44 64.77,66.8 64.77,63.63 63.5,63.63 WAITSTATES.7
N$29  (via drill 0.61)
  Top 0.254: v85.09,47.75 85.09,62.99 83.82,64.26 IC8.3
  Bottom 0.254: v85.09,47.75 69.85,47.75 IC7.13
N$30
  Bottom 0.254: IC8.6 92.08,64.9 93.34,63.63 107.31,63.63 108.59,64.9 IC4.4
N$31
  Top 0.254: IC11.10 66.04,71.88 62.23,68.07 62.23,63.63 61.59,62.99 WAITSTATES.9
N$32
  Top 0.254: R22.1 93.98,38.23 93.98,41.4 IC9.9
N$34
  Top 0.254: IC11.11 63.5,71.88 59.69,68.07 59.69,63.63 59.05,62.99 WAITSTATES.11
N$35
  Top 0.254: IC11.12 60.33,72.52 54.61,66.8 54.61,63.63 55.25,62.99 WAITSTATES.13
N$36
  Top 0.254: IC11.13 58.42,71.88 53.34,66.8 53.34,63.63 WAITSTATES.15
N$37
  Bottom 0.254: Q1.2 21.59,18.54 21.59,16 17.14,16 13.97,19.18 13.97,38.86 57.15,38.86 59.69,41.4 64.77,41.4 67.31,38.86 76.84,38.86 78.11,37.59 83.19,37.59 R22.2
N$39
  Bottom 0.254: IC11.1 56.52,64.9 57.78,64.9 IC11.2 59.05,66.17 60.96,68.07 111.76,68.07 113.67,66.17 IC4.6
OCLK  (via drill 0.61)
  Top 0.254: v76.2,35.05 77.47,36.32 77.47,52.83 78.74,54.1 SV2.1
  Bottom 0.254: v76.2,35.05 69.85,35.05 IC7.8
PIN9  (via drill 0.61)
  Top 0.254: v99.69,52.2 99.69,68.07 83.82,68.07 82.55,66.8 82.55,59.18 78.74,59.18 76.2,56.64 SV2.2
  Bottom 0.254: v99.69,52.2 104.78,47.12 113.03,47.12 115.57,44.58 115.57,22.99 112.39,22.99 X1.9
PIN22  (via drill 0.61)
  Top 0.762: v70.48,25.53 70.48,22.99 67.31,19.81 PIN22.2 | v99.06,26.16 102.23,22.99 102.23,16 107.95,10.29 116.2,10.29 116.2,20.45 114.94,21.72 X1.22
  Bottom 0.762: v70.48,25.53 71.12,26.16 v99.06,26.16
QC  (via drill 0.61)
  Top 0.254: v76.2,33.78 80.01,37.59 80.01,40.13 81.28,41.4 IC9.4 | v55.88,33.78 54.61,35.05 54.61,56.01 46.99,63.63 43.18,63.63 43.18,64.26 IC5.5
  Bottom 0.254: v76.2,33.78 v55.88,33.78
RESET  (via drill 0.61)
  Top 0.254: v87.63,10.29 87.63,13.46 82.55,18.54 82.55,22.99 74.93,30.61 74.93,40.13 76.2,41.4 IC9.2
  Bottom 0.254: v87.63,10.29 89.53,8.38 92.71,8.38 93.34,7.75 ST2.B2
STROBE  (via drill 0.61)
  Top 0.254: v91.44,47.75 91.44,46.48 88.9,43.94 IC9.7 | v100.33,47.75 105.41,52.83 105.41,62.99 106.68,64.26 IC4.3
  Bottom 0.254: v91.44,47.75 v100.33,47.75
VCC  (via drill 0.61)
  Top 0.762: C11.1 99.06,49.66 101.6,52.2 101.6,64.26 IC4.1 101.6,66.8 101.6,71.88 IC4.14 | IC3.1 30.48,16 30.48,21.08 IC3.20 | v27.31,14.73 27.31,12.19 25.4,10.29 R23.2 | v71.75,32.51 71.75,28.7 73.03,27.43 73.03,21.72 73.66,21.08 IC2.20 73.66,18.54 v75.56,16.64 | IC9.20 73.03,50.29 69.85,50.29 IC7.14 67.94,50.93 67.94,56.64 66.04,56.64 65.41,56.01 65.41,33.78 66.68,32.51 C8.1 67.31,31.88 62.87,27.43 62.87,24.26 v59.69,21.08 | v31.11,54.74 31.11,69.98 33.02,71.88 IC5.14
  Bottom 0.762: IC5.14 33.66,72.52 35.56,70.61 48.89,70.61 50.17,71.88 C10.1 51.44,71.88 52.07,72.52 55.25,72.52 IC11.14 56.52,73.79 58.42,75.69 71.75,75.69 74.93,72.52 | 74.93,72.52 74.3,71.88 C9.1 | 74.93,72.52 78.11,72.52 IC8.14 79.38,72.52 81.28,70.61 104.14,70.61 | C12.1 97.16,71.88 97.79,72.52 100.97,72.52 IC4.14 102.23,72.52 104.14,70.61 | 104.14,70.61 117.47,70.61 118.75,71.88 C7.1 | R23.2 25.4,9.02 25.4,7.75 ST2.B29 | 27.94,15.37 27.94,17.27 29.84,19.18 54.61,19.18 55.88,20.45 C5.1 56.52,21.08 v59.69,21.08 | 27.94,15.37 29.84,15.37 IC3.1 | 27.94,15.37 v27.31,14.73 | v71.75,32.51 67.94,32.51 C8.1 | IC7.14 67.31,50.29 65.41,52.2 59.69,52.2 56.52,49.02 C4.1 55.25,49.02 53.34,47.12 38.73,47.12 36.2,49.66 IC1.16 34.92,50.93 v31.11,54.74 | v75.56,16.64 97.79,16.64 99.06,17.91 C6.1
VCCO  (via drill 0.61)
  Top 0.762: v108.59,38.86 108.59,22.99 111.12,20.45 X1.10
  Bottom 0.762: IC10.3 18.42,33.78 21.59,30.61 24.77,30.61 C1.+ 26.03,29.97 93.98,29.97 96.52,27.43 106.68,27.43 109.86,24.26 109.86,21.72 111.12,20.45 X1.10 | v108.59,38.86 109.22,39.5 111.12,39.5 X1.3
WS  (via drill 0.61)
  Top 0.254: WAITSTATES.16 53.98,60.45 55.25,60.45 WAITSTATES.14 | WAITSTATES.12 59.05,60.45 60.33,60.45 WAITSTATES.10 61.59,60.45 62.87,60.45 WAITSTATES.8 64.14,60.45 65.41,60.45 WAITSTATES.6 66.68,60.45 67.94,60.45 WAITSTATES.4 69.22,60.45 70.48,60.45 WAITSTATES.2 | v92.71,56.01 92.71,45.21 91.44,43.94 IC9.8
  Bottom 0.254: WAITSTATES.12 57.78,60.45 56.52,60.45 WAITSTATES.14 | v92.71,56.01 90.17,58.55 73.66,58.55 71.75,60.45 WAITSTATES.2